# EAGLE schematic Lab-10 (EAGLE 9.6.2)
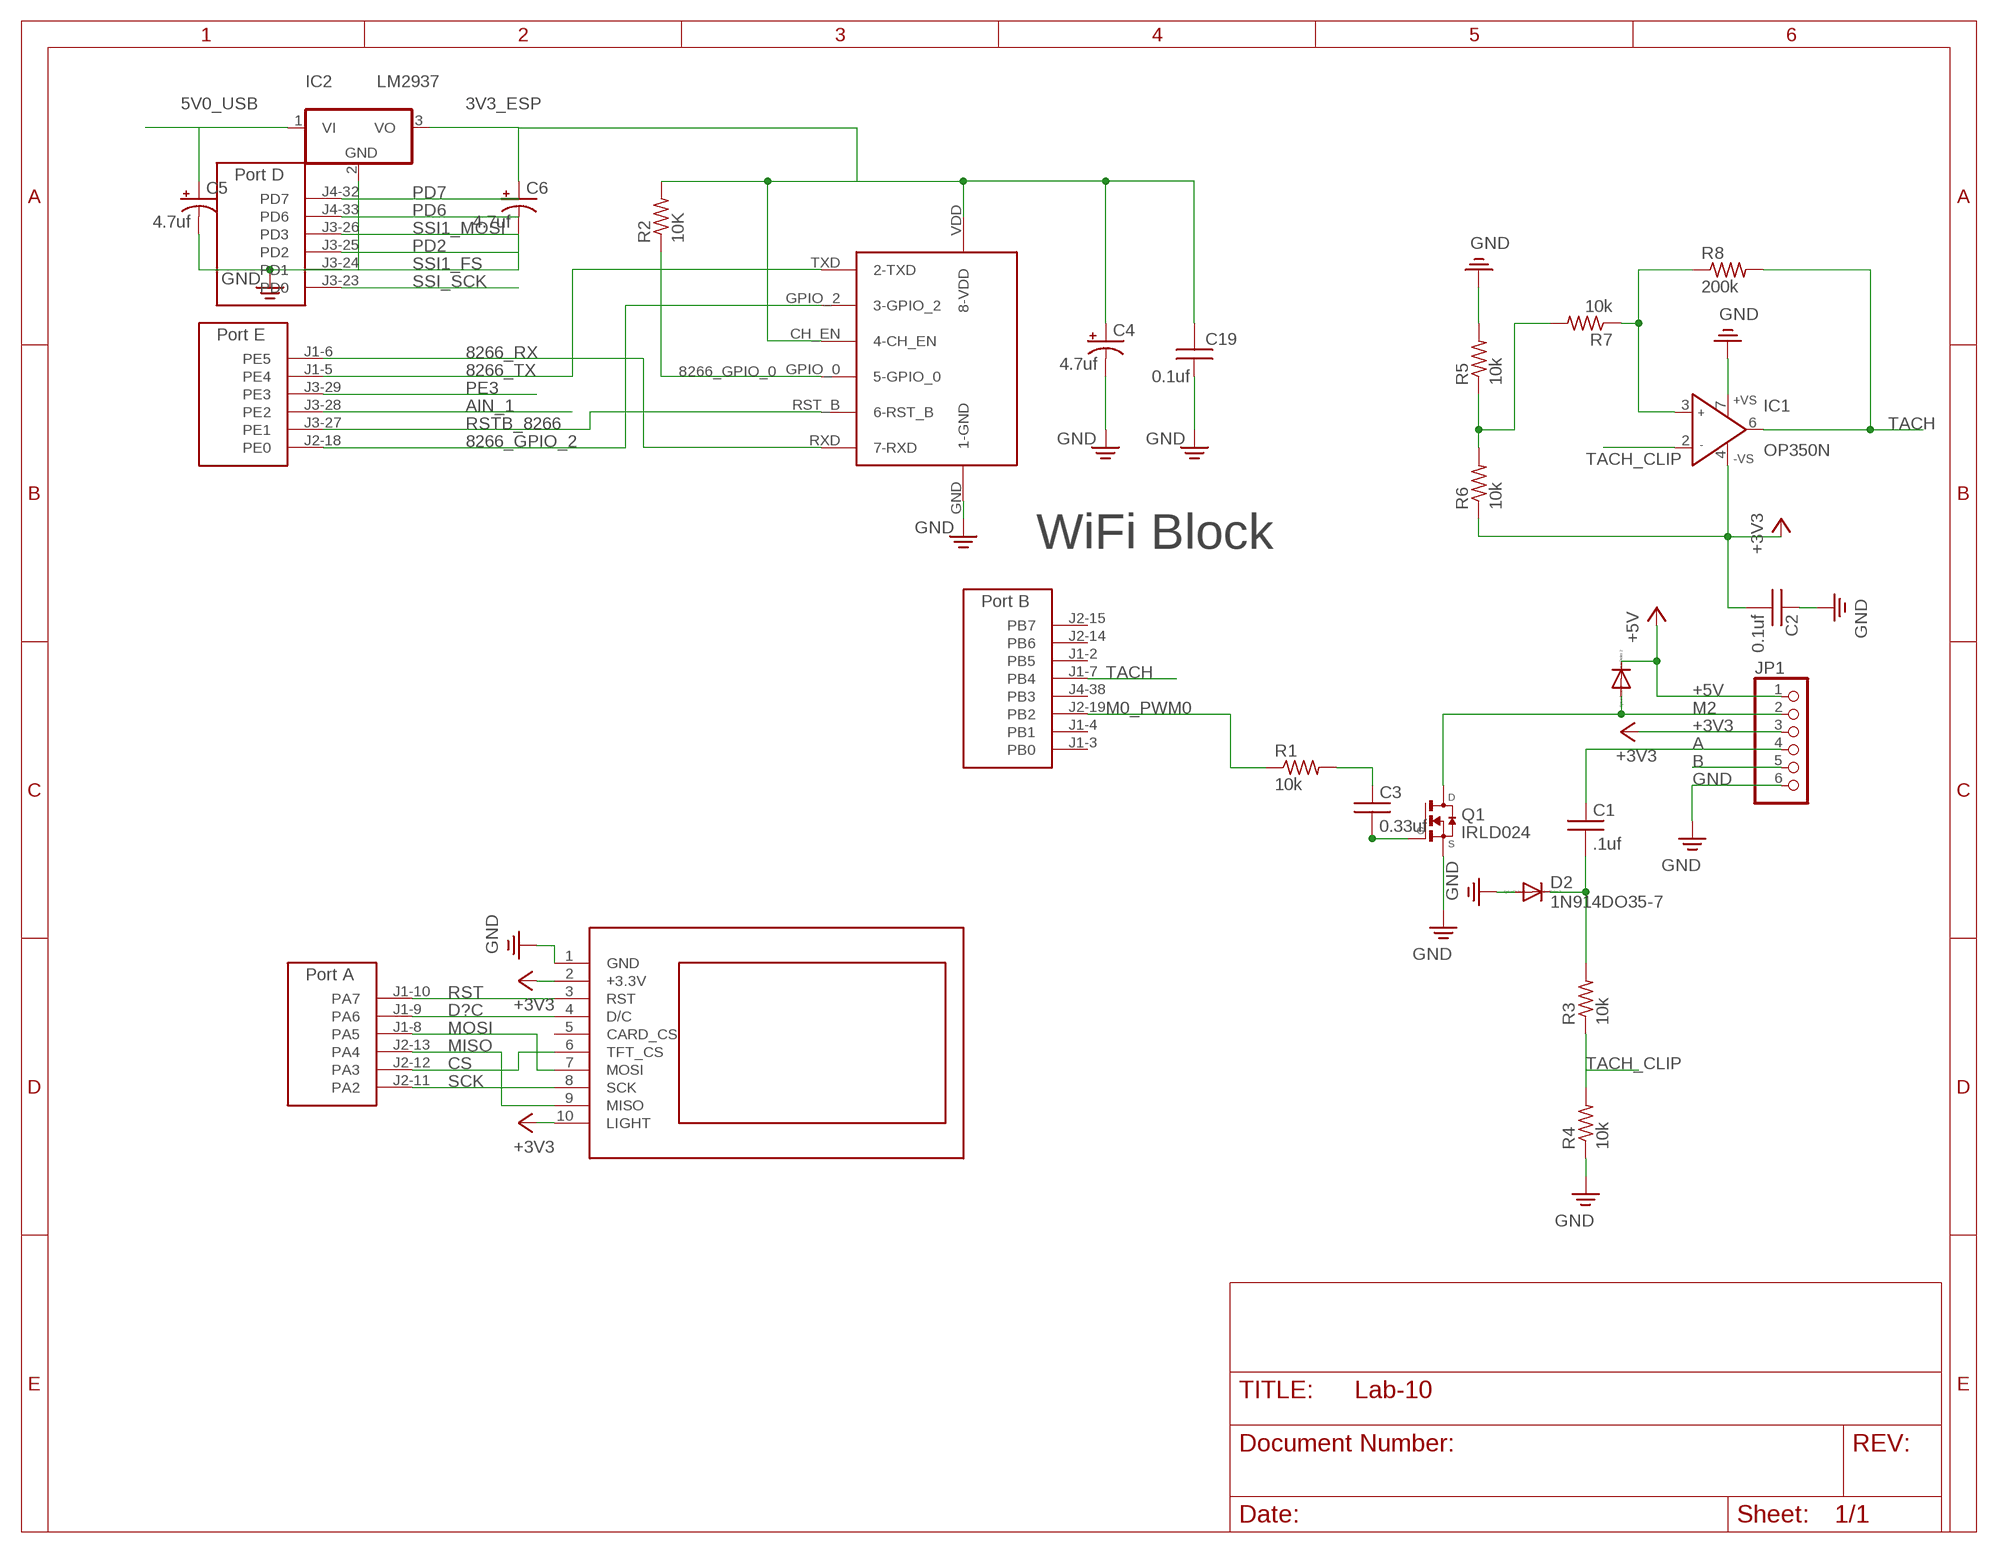
[diagram p0: schematic, sheet 1]

## Parts
C1  .1uf  CAPACITOR025-024X044  [CAP100MIL]
C2  0.1uf  CAPACITOR025-024X044  [CAP100MIL]
C3  0.33uf  CAPACITOR025-024X044  [CAP100MIL]
C4  4.7uf  CAPACITOR_POLARIZEDE5-6  [CAP200MILPOLARIZED]
C5  4.7uf  CAPACITOR_POLARIZEDE5-6  [CAP200MILPOLARIZED]
C6  4.7uf  CAPACITOR_POLARIZEDE5-6  [CAP200MILPOLARIZED]
C19  0.1uf  CAPACITOR050-024X044  [CAP200MIL]
D1  1N914DO35-7  [DO35-7]
D2  1N914DO35-7  [DO35-7]
IC1  OP350N  [DIL08]
IC2  LM2937  [TO263-3]
JP1  PINHD-1X6  [1X06]
Q1  IRLD024  [IRLD024]
R1  10k  RESISTOR0204/5  [RES200MIL]
R2  10K  RESISTOR0204/7  [RES300MIL]
R3  10k  RESISTOR0204/7  [RES300MIL]
R4  10k  RESISTOR0204/7  [RES300MIL]
R5  10k  RESISTOR0204/5  [RES200MIL]
R6  10k  RESISTOR0204/5  [RES200MIL]
R7  10k  RESISTOR0204/5  [RES200MIL]
R8  200k  RESISTOR0204/5  [RES200MIL]
U$1  TM4C_BP  [TM4C_BOOSTER_PACK]
U$2  ST7735  [ST7735]
U$3  ESP_8266  [ESP8266]
U$4  TM4C_BP  [TM4C_BOOSTER_PACK]
U$5  TM4C_BP  [TM4C_BOOSTER_PACK]

## Nets
3V3_ESP: C4.+ C6.+ C19.2 IC2.3(VO) R2.2 U$3.CH_EN(4-CH_EN) U$3.VDD(8-VDD)
5V0_USB: C5.+ IC2.1(VI)
8266_GPIO_0: R2.1 U$3.GPIO_0(5-GPIO_0)
8266_GPIO_2: U$3.GPIO_2(3-GPIO_2) U$4.J2-18(PE0)
8266_RX: U$3.RXD(7-RXD) U$4.J1-6(PE5)
8266_TX: U$3.TXD(2-TXD) U$4.J1-5(PE4)
+3V3: C2.2 IC1.4(-VS) JP1.3 R6.1 U$2.2(+3.3V) U$2.10(LIGHT)
+5V: D1.C JP1.1
A: C1.1 JP1.4
AIN_1: U$4.J3-28(PE2)
B: JP1.5
CS: U$1.J2-12(PA3) U$2.6(TFT_CS)
D?C: U$1.J1-9(PA6) U$2.4(D/C)
GND: C2.1 C4.- C5.- C6.- C19.1 D2.A IC1.7(+VS) IC2.2(GND) JP1.6 Q1.P$4(S) R4.1 R5.2 U$2.1(GND) U$3.GND(1-GND)
M0_PWM0: R1.1 U$1.J2-19(PB2)
M2: D1.A JP1.2 Q1.P$1(D)
MISO: U$1.J2-13(PA4) U$2.9(MISO)
MOSI: U$1.J1-8(PA5) U$2.7(MOSI)
N$1: C3.1 R1.2
N$2: C1.2 D2.C R3.2
N$3: C3.2 Q1.P$3(G)
N$5: R5.1 R6.2 R7.2
N$6: IC1.3(IN+) R7.1 R8.1
PD2: U$5.J3-25(PD2)
PD6: U$5.J4-33(PD6)
PD7: U$5.J4-32(PD7)
PE3: U$4.J3-29(PE3)
RST: U$1.J1-10(PA7) U$2.3(RST)
RSTB_8266: U$3.RST_B(6-RST_B) U$4.J3-27(PE1)
SCK: U$1.J2-11(PA2) U$2.8(SCK)
SSI1_FS: U$5.J3-24(PD1)
SSI1_MOSI: U$5.J3-26(PD3)
SSI_SCK: U$5.J3-23(PD0)
TACH: IC1.6(OUT) R8.2 U$1.J1-7(PB4)
TACH_CLIP: IC1.2(IN-) R3.1 R4.2
Unconnected: U$1.J1-1(+3.3V) U$1.J1-2(PB5) U$1.J1-3(PB0) U$1.J1-4(PB1) U$1.J1-5(PE4) U$1.J1-6(PE5) U$1.J2-14(PB6) U$1.J2-15(PB7) U$1.J2-16(RESET) U$1.J2-17(PF0) U$1.J2-18(PE0) U$1.J2-20(GND2) U$1.J3-21(+5.0V) U$1.J3-22(GND1) U$1.J3-23(PD0) U$1.J3-24(PD1) U$1.J3-25(PD2) U$1.J3-26(PD3) U$1.J3-27(PE1) U$1.J3-28(PE2) U$1.J3-29(PE3) U$1.J3-30(PF1) U$1.J4-31(PF4) U$1.J4-32(PD7) U$1.J4-33(PD6) U$1.J4-34(PC7) U$1.J4-35(PC6) U$1.J4-36(PC5) U$1.J4-37(PC4) U$1.J4-38(PB3) U$1.J4-39(PF3) U$1.J4-40(PF2) U$2.5(CARD_CS) U$4.J1-1(+3.3V) U$4.J1-2(PB5) U$4.J1-3(PB0) U$4.J1-4(PB1) U$4.J1-7(PB4) U$4.J1-8(PA5) U$4.J1-9(PA6) U$4.J1-10(PA7) U$4.J2-11(PA2) U$4.J2-12(PA3) U$4.J2-13(PA4) U$4.J2-14(PB6) U$4.J2-15(PB7) U$4.J2-16(RESET) U$4.J2-17(PF0) U$4.J2-19(PB2) U$4.J2-20(GND2) U$4.J3-21(+5.0V) U$4.J3-22(GND1) U$4.J3-23(PD0) U$4.J3-24(PD1) U$4.J3-25(PD2) U$4.J3-26(PD3) U$4.J3-30(PF1) U$4.J4-31(PF4) U$4.J4-32(PD7) U$4.J4-33(PD6) U$4.J4-34(PC7) U$4.J4-35(PC6) U$4.J4-36(PC5) U$4.J4-37(PC4) U$4.J4-38(PB3) U$4.J4-39(PF3) U$4.J4-40(PF2) U$5.J1-1(+3.3V) U$5.J1-2(PB5) U$5.J1-3(PB0) U$5.J1-4(PB1) U$5.J1-5(PE4) U$5.J1-6(PE5) U$5.J1-7(PB4) U$5.J1-8(PA5) U$5.J1-9(PA6) U$5.J1-10(PA7) U$5.J2-11(PA2) U$5.J2-12(PA3) U$5.J2-13(PA4) U$5.J2-14(PB6) U$5.J2-15(PB7) U$5.J2-16(RESET) U$5.J2-17(PF0) U$5.J2-18(PE0) U$5.J2-19(PB2) U$5.J2-20(GND2) U$5.J3-21(+5.0V) U$5.J3-22(GND1) U$5.J3-27(PE1) U$5.J3-28(PE2) U$5.J3-29(PE3) U$5.J3-30(PF1) U$5.J4-31(PF4) U$5.J4-34(PC7) U$5.J4-35(PC6) U$5.J4-36(PC5) U$5.J4-37(PC4) U$5.J4-38(PB3) U$5.J4-39(PF3) U$5.J4-40(PF2)

## Notes on the sheet
- WiFi Block

## Library data of the parts
C1-C3 C19 = EE445L:CAPACITOR: CAPACITOR, American symbol
C4-C6 = EE445L:CAPACITOR_POLARIZED: POLARIZED CAPACITOR, American symbol
D1 D2 = EE445L:1N914: DIODE high speed (Philips) 1N914
IC1 = EE445L:OP350: 2.7V to 5.5V Rail-to-Rail I/O Amplifier High-Speed 38MHz, Single-Supply, slew rate 22V/us, 500uV offset, 4uV noise; MPN: AD8031BNZ; OC_FARNELL: 1438575; OC_NEWARK: 15P0920
IC2 = linear:LM2937: LM2937-2.5, LM2937-3.3 400mA and 500mA Voltage Regulators Source: http://cache.national.com/ds/LM/LM2937-2.5.pdf
JP1 = EE445L:PINHD-1X6: PIN HEADER
Q1 = EE445L:IRLD024: N-Channel Enhancement MOSFET
R1-R8 = EE445L:RESISTOR: RESISTOR, American symbol
U$1 U$4 U$5 = EE445L:TM4C_BP
U$2 = EE445L:ST7735
U$3 = EE445L:ESP_8266